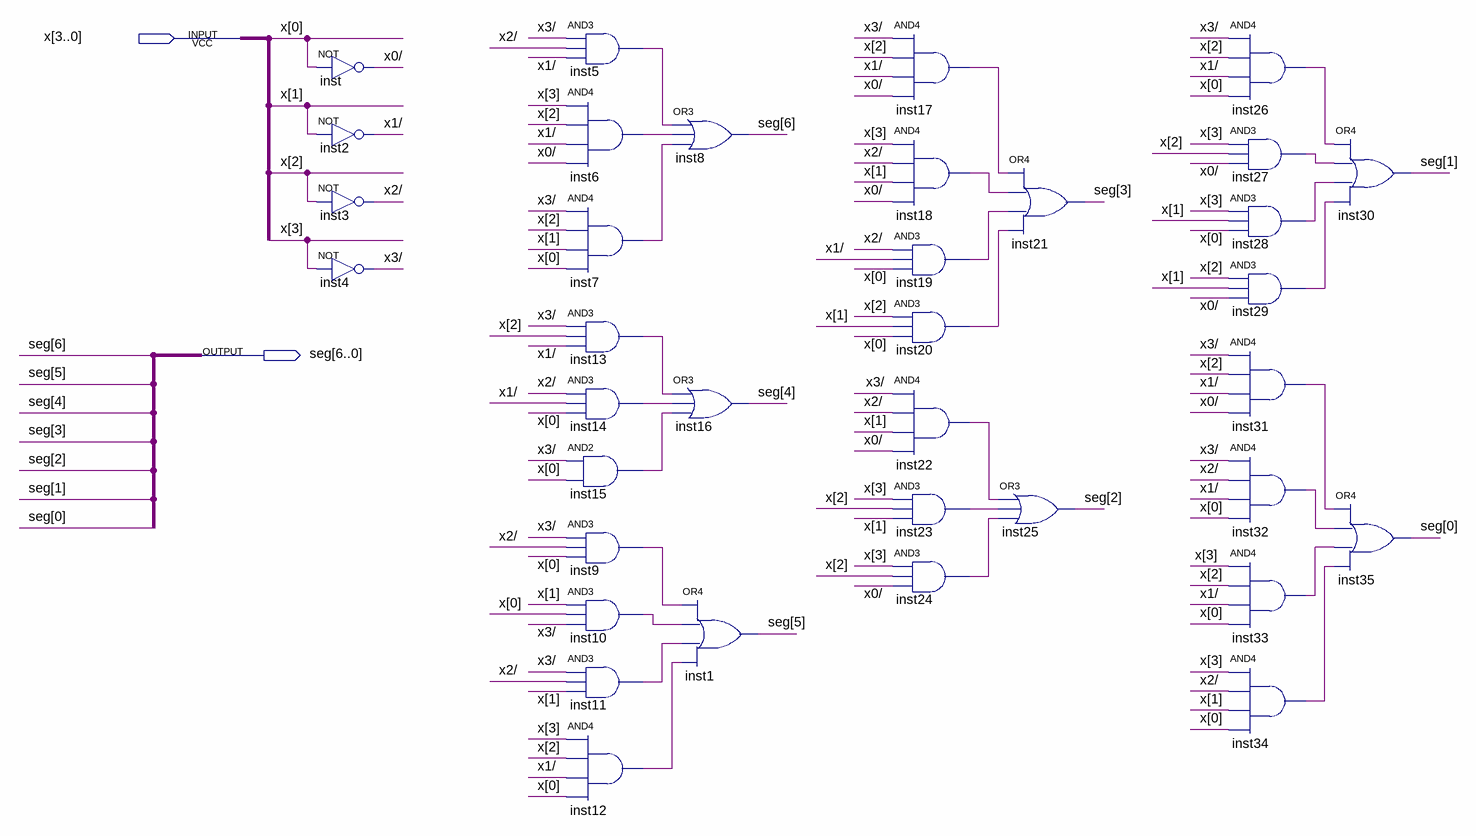
[diagram p0: schematic sheet]
// Quartus schematic bus_decodificador_7seg.bdf as structural Verilog: 36 symbols, 2 pins
module bus_decodificador_7seg (
  input  [3:0] x,
  output [6:0] seg
);

  wire inst5_out, inst6_out, inst7_out, inst9_out, inst10_out, inst11_out, inst12_out, inst13_out,
       inst14_out, inst15_out, inst17_out, inst18_out, inst19_out, inst20_out, inst22_out, inst23_out,
       inst24_out, inst26_out, inst27_out, inst28_out, inst29_out, inst31_out, inst32_out, inst33_out,
       inst34_out, \x0/ , \x1/ , \x2/ , \x3/ ;

  not inst (\x0/ , x[0]);
  not inst2 (\x1/ , x[1]);
  not inst3 (\x2/ , x[2]);
  not inst4 (\x3/ , x[3]);
  and inst5 (inst5_out, \x3/ , \x2/ , \x1/ );
  and inst6 (inst6_out, x[3], x[2], \x1/ , \x0/ );
  and inst7 (inst7_out, \x3/ , x[2], x[1], x[0]);
  and inst13 (inst13_out, \x3/ , x[2], \x1/ );
  and inst14 (inst14_out, \x2/ , \x1/ , x[0]);
  and inst15 (inst15_out, \x3/ , x[0]);
  and inst9 (inst9_out, \x3/ , \x2/ , x[0]);
  and inst10 (inst10_out, x[1], x[0], \x3/ );
  and inst11 (inst11_out, \x3/ , \x2/ , x[1]);
  and inst12 (inst12_out, x[3], x[2], \x1/ , x[0]);
  or inst8 (seg[6], inst5_out, inst6_out, inst7_out);
  or inst16 (seg[4], inst13_out, inst14_out, inst15_out);
  or inst1 (seg[5], inst9_out, inst10_out, inst11_out, inst12_out);
  and inst17 (inst17_out, \x3/ , x[2], \x1/ , \x0/ );
  and inst18 (inst18_out, x[3], \x2/ , x[1], \x0/ );
  and inst19 (inst19_out, \x2/ , \x1/ , x[0]);
  and inst20 (inst20_out, x[2], x[1], x[0]);
  and inst22 (inst22_out, \x3/ , \x2/ , x[1], \x0/ );
  and inst23 (inst23_out, x[3], x[2], x[1]);
  and inst24 (inst24_out, x[3], x[2], \x0/ );
  or inst21 (seg[3], inst17_out, inst18_out, inst19_out, inst20_out);
  or inst25 (seg[2], inst22_out, inst23_out, inst24_out);
  and inst26 (inst26_out, \x3/ , x[2], \x1/ , x[0]);
  and inst27 (inst27_out, x[3], x[2], \x0/ );
  and inst28 (inst28_out, x[3], x[1], x[0]);
  and inst29 (inst29_out, x[2], x[1], \x0/ );
  and inst31 (inst31_out, \x3/ , x[2], \x1/ , \x0/ );
  and inst32 (inst32_out, \x3/ , \x2/ , \x1/ , x[0]);
  and inst33 (inst33_out, x[3], x[2], \x1/ , x[0]);
  and inst34 (inst34_out, x[3], \x2/ , x[1], x[0]);
  or inst30 (seg[1], inst26_out, inst27_out, inst28_out, inst29_out);
  or inst35 (seg[0], inst31_out, inst32_out, inst33_out, inst34_out);
endmodule
